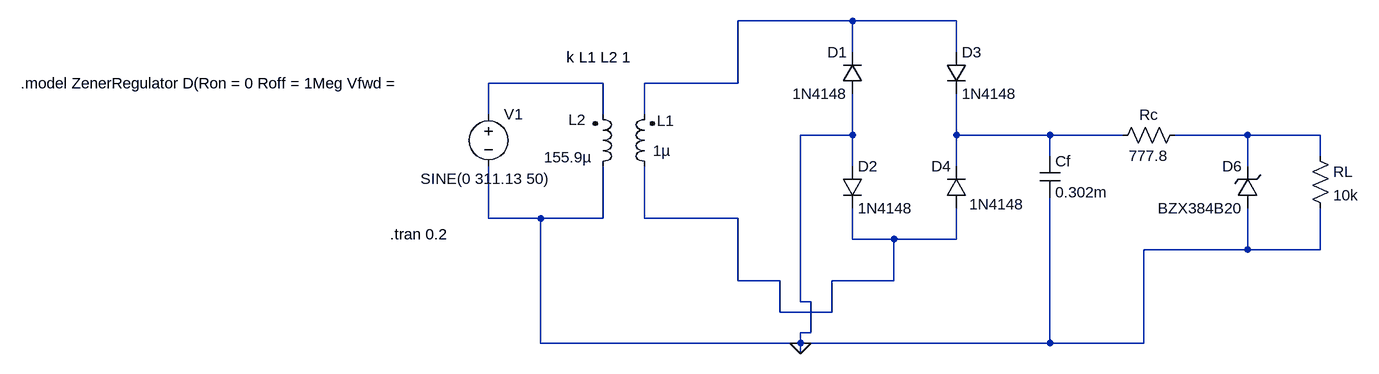
[diagram p0: schematic LTSpiceSimulation.asc]
LTSpiceSimulation.asc, the LTspice schematic file:
Version 4
SHEET 1 2564 680
WIRE 1056 -80 880 -80
WIRE 1216 -80 1056 -80
WIRE 1056 -32 1056 -80
WIRE 1216 -32 1216 -80
WIRE 672 16 496 16
WIRE 880 16 880 -80
WIRE 880 16 736 16
WIRE 496 64 496 16
WIRE 672 64 672 16
WIRE 736 64 736 16
WIRE 1056 96 1056 32
WIRE 1056 96 976 96
WIRE 1216 96 1216 32
WIRE 1360 96 1216 96
WIRE 1472 96 1360 96
WIRE 1664 96 1552 96
WIRE 1776 96 1664 96
WIRE 1360 128 1360 96
WIRE 1776 128 1776 96
WIRE 1056 144 1056 96
WIRE 1216 144 1216 96
WIRE 1664 144 1664 96
WIRE 496 224 496 144
WIRE 576 224 496 224
WIRE 672 224 672 144
WIRE 672 224 576 224
WIRE 736 224 736 144
WIRE 880 224 736 224
WIRE 1056 256 1056 208
WIRE 1120 256 1056 256
WIRE 1216 256 1216 208
WIRE 1216 256 1120 256
WIRE 1664 272 1664 208
WIRE 1664 272 1504 272
WIRE 1776 272 1776 208
WIRE 1776 272 1664 272
WIRE 880 320 880 224
WIRE 944 320 880 320
WIRE 1120 320 1120 256
WIRE 1120 320 1024 320
WIRE 976 352 976 96
WIRE 992 352 976 352
WIRE 944 368 944 320
WIRE 1024 368 1024 320
WIRE 1024 368 944 368
WIRE 992 400 992 352
WIRE 992 400 976 400
WIRE 576 416 576 224
WIRE 976 416 976 400
WIRE 976 416 576 416
WIRE 1360 416 1360 192
WIRE 1360 416 976 416
WIRE 1504 416 1504 272
WIRE 1504 416 1360 416
WIRE 976 432 976 416
FLAG 976 416 0
SYMBOL ind2 656 160 M180
WINDOW 0 -37 88 Left 2
WINDOW 3 -75 30 Left 2
SYMATTR InstName L2
SYMATTR Value 155.9µ
SYMATTR Type ind
SYMATTR SpiceLine Rser=0.00001
SYMBOL ind2 752 160 R180
WINDOW 0 -30 86 Left 2
WINDOW 3 -24 40 Left 2
SYMATTR InstName L1
SYMATTR Value 1µ
SYMATTR Type ind
SYMBOL voltage 496 48 R0
WINDOW 3 -105 115 Left 2
WINDOW 123 0 0 Left 0
WINDOW 39 0 0 Left 0
SYMATTR Value SINE(0 311.13 50)
SYMATTR InstName V1
SYMBOL diode 1072 32 R180
WINDOW 0 24 64 Left 2
WINDOW 3 24 0 Left 2
SYMATTR InstName D1
SYMATTR Value 1N4148
SYMBOL diode 1040 144 R0
SYMATTR InstName D2
SYMATTR Value 1N4148
SYMBOL diode 1200 -32 R0
SYMATTR InstName D3
SYMATTR Value 1N4148
SYMBOL diode 1232 208 R180
WINDOW 0 24 64 Left 2
WINDOW 3 -89 6 Left 2
SYMATTR InstName D4
SYMATTR Value 1N4148
SYMBOL cap 1344 128 R0
SYMATTR InstName Cf
SYMATTR Value 0.302m
SYMBOL res 1760 112 R0
SYMATTR InstName RL
SYMATTR Value 10k
SYMBOL zener 1680 208 R180
WINDOW 0 24 64 Left 2
WINDOW 3 24 0 Left 2
SYMATTR InstName D6
SYMATTR Value BZX384B20
SYMBOL res 1568 80 R90
WINDOW 0 0 56 VBottom 2
WINDOW 3 32 56 VTop 2
SYMATTR InstName Rc
SYMATTR Value 777.8
TEXT 616 -24 Left 2 !k L1 L2 1
TEXT 344 248 Left 2 !.tran 0.2
TEXT -224 16 Left 2 !.model ZenerRegulator D(Ron = 0 Roff = 1Meg Vfwd =

The netlist it stands for:
* LTSpiceSimulation.asc
L2 0 N002 155.9µ Rser=0.00001
L1 N005 N001 1µ
V1 N002 0 SINE(0 311.13 50)
D1 0 N001 1N4148
D2 0 N005 1N4148
D3 N001 N003 1N4148
D4 N005 N003 1N4148
Cf N003 0 0.302m
RL N004 0 10k
D6 0 N004 BZX384B20
Rc N004 N003 777.8
.model D D
.lib standard.dio
k L1 L2 1
.tran 0.2
.model ZenerRegulator D(Ron = 0 Roff = 1Meg Vfwd =
.backanno
.end